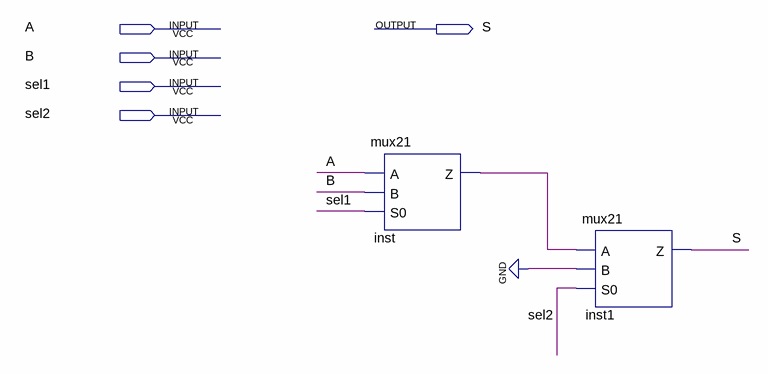
[diagram p0: schematic sheet]
// Quartus schematic muxSMZ.bdf as structural Verilog: 2 symbols, 5 pins
module muxSMZ (
  input  A,
  input  B,
  input  sel1,
  input  sel2,
  output S
);

  wire inst_z;

  mux21 inst (.A(A), .B(B), .S0(sel1), .Z(inst_z));
  mux21 inst1 (.A(inst_z), .B(1'b0), .S0(sel2), .Z(S));
endmodule
